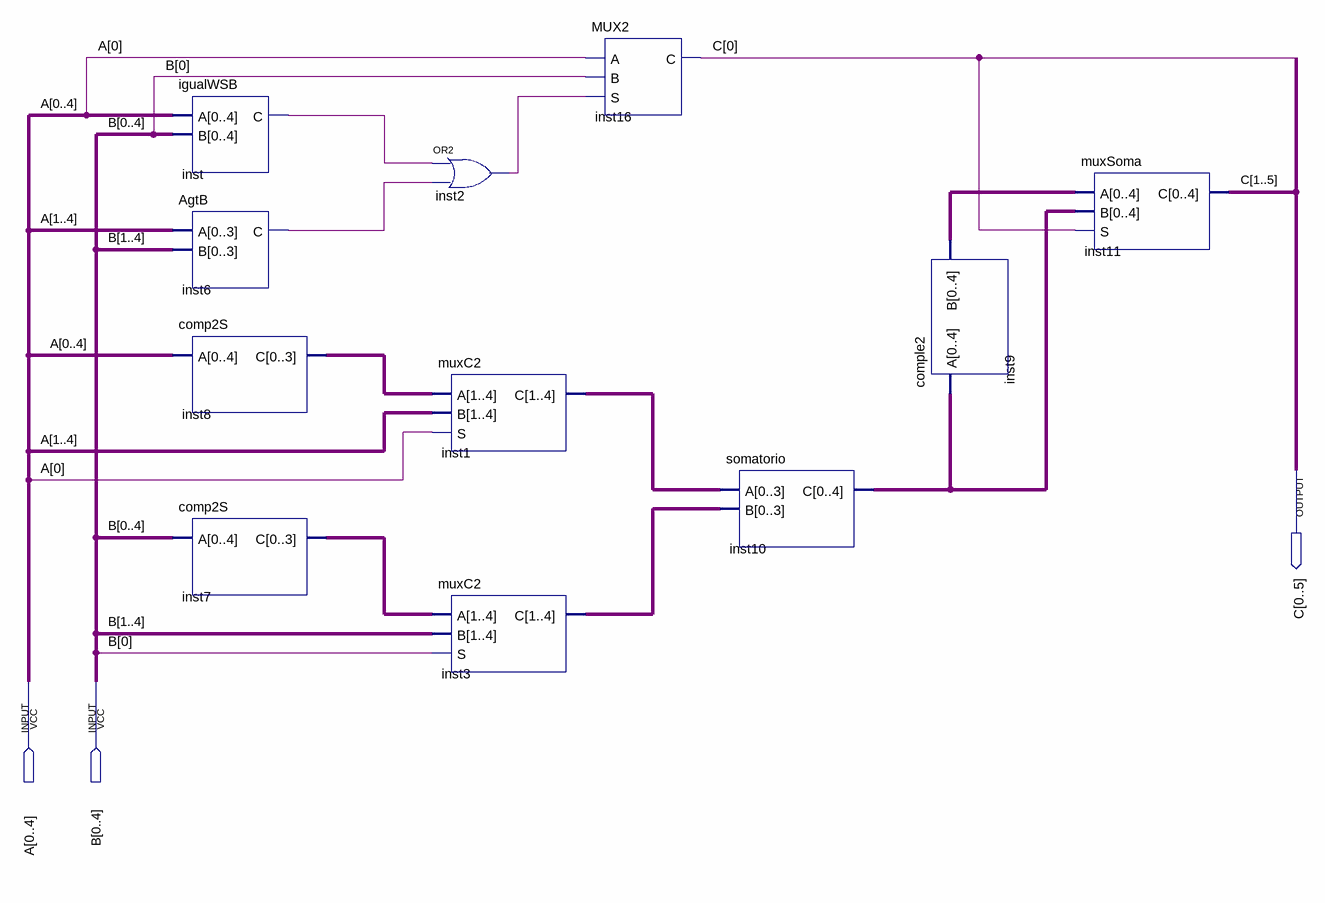
[diagram p0: schematic sheet]
// Quartus schematic somador.bdf as structural Verilog: 11 symbols, 3 pins
module somador (
  input  [0:4] A,
  input  [0:4] B,
  output [0:5] C
);

  wire inst2_out, inst6_c, inst_c;
  wire [3:0] inst1_c, inst3_c, inst7_c, inst8_c;
  wire [4:0] inst9_b, inst10_c;

  igualWSB inst (.A(A), .B(B), .C(inst_c));
  AgtB inst6 (.A(A[1:4]), .B(B[1:4]), .C(inst6_c));
  comp2S inst8 (.A(A), .C(inst8_c));
  comp2S inst7 (.A(B), .C(inst7_c));
  or inst2 (inst2_out, inst_c, inst6_c);
  muxC2 inst1 (.A(inst8_c), .B(A[1:4]), .S(A[0]), .C(inst1_c));
  muxC2 inst3 (.A(inst7_c), .B(B[1:4]), .S(B[0]), .C(inst3_c));
  MUX2 inst16 (.A(A[0]), .B(B[0]), .S(inst2_out), .C(C[0]));
  somatorio inst10 (.A(inst1_c), .B(inst3_c), .C(inst10_c));
  comple2 inst9 (.A(inst10_c), .B(inst9_b));
  muxSoma inst11 (.A(inst9_b), .B(inst10_c), .S(C[0]), .C(C[1:5]));
endmodule
